# Altium schematic sheet AD9833_drive.SchDoc
size A3
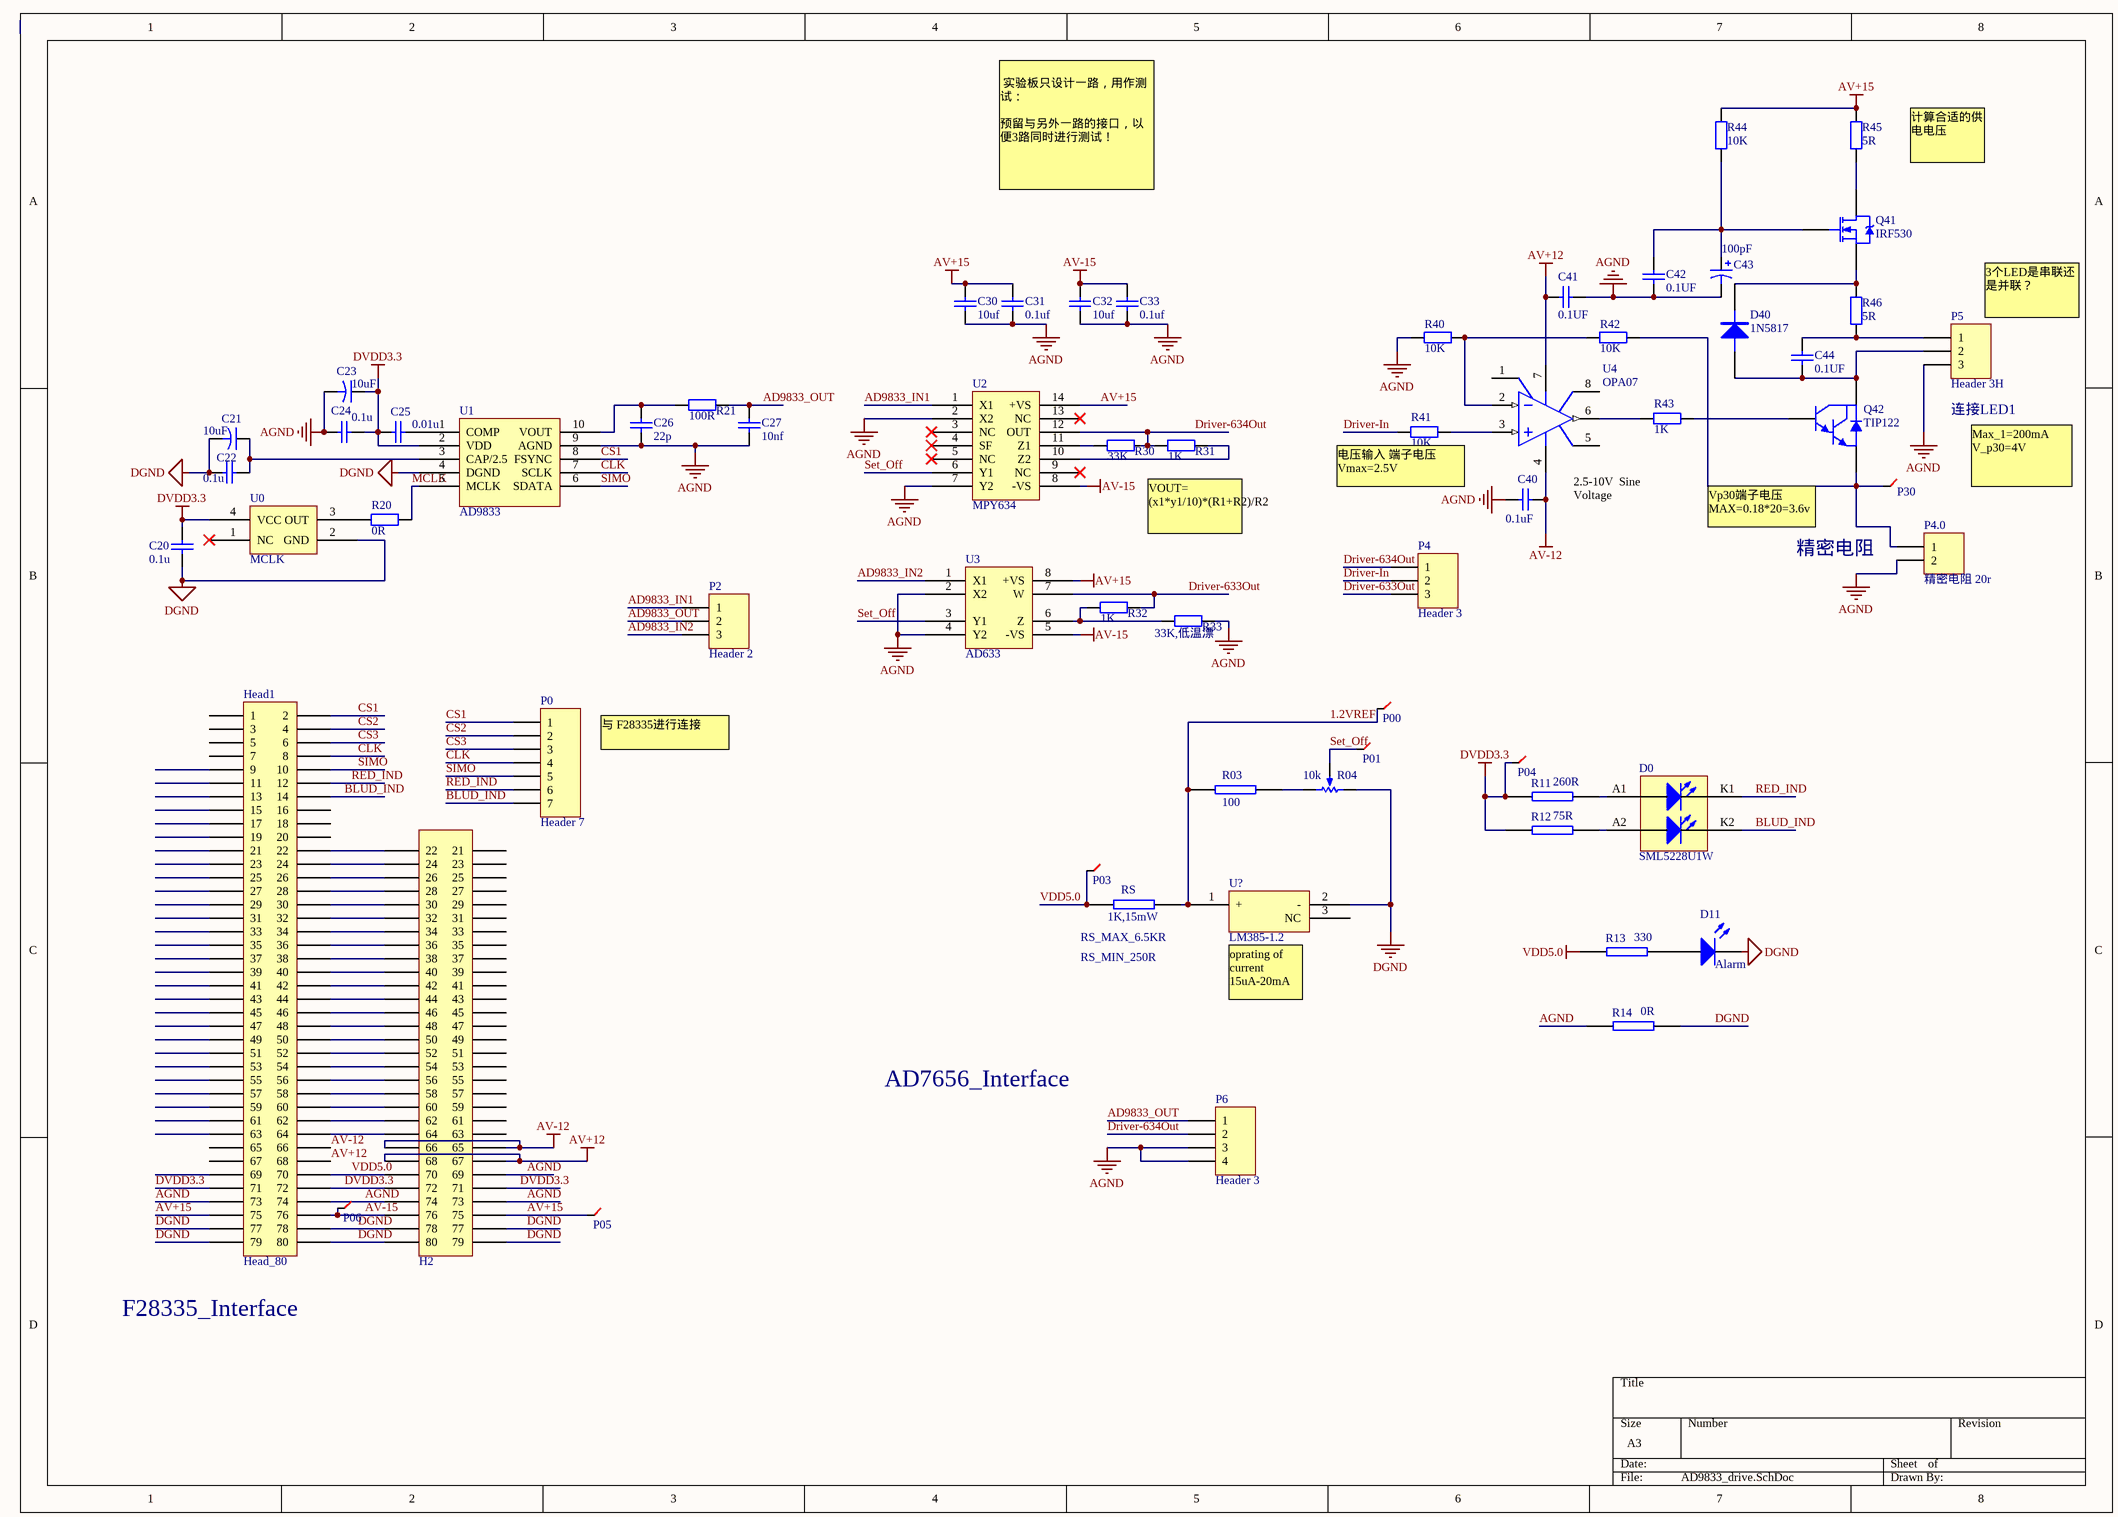
[diagram p0: AD9833_drive.SchDoc]

## Parts
C20  value 0.1u  [0805]  (hidden comment: Cap)
C21  value 10uF  [0805]  (hidden comment: Cap2)
C22  value 0.1u  [0805]  (hidden comment: Cap)
C23  value 10uF  [0805]  (hidden comment: Cap2)
C24  value 0.1u  [0805]  (hidden comment: Cap)
C25  value 0.01u  [0805]  (hidden comment: Cap)
C26  value 22p  [0805]  (hidden comment: Cap)
C27  value 10nf  [0805]  (hidden comment: Cap)
C30  value 10uf  [0805]  (hidden comment: Cap)
C31  value 0.1uf  [0805]  (hidden comment: Cap)
C32  value 10uf  [0805]  (hidden comment: Cap)
C33  value 0.1uf  [0805]  (hidden comment: Cap)
C40  value 0.1uF  [0805]  (hidden comment: Cap)
C41  value 0.1UF  [0805]  (hidden comment: Cap)
C42  value 0.1UF  [0805]  (hidden comment: Cap)
C43  value 100pF  [0805]  (hidden comment: Cap Pol1)
C44  value 0.1UF  [0805]  (hidden comment: Cap)
D0  SML5228U1W  [LED_0603双色]
D11  Alarm  [LED_0805]
D40  1N5817  [DIODE-SMA]
H2  Head60  [Head_60pin]  (value not drawn)
Head1  Head_80  [2.0mm]
P0  Header 7  [HDR1X7]
P00  测试点  (value not drawn)
P01  测试点  (value not drawn)
P2  Header 2  [HDR1X3]
P03  测试点  (value not drawn)
P4  Header 3  [HDR1X3]
P04  测试点  (value not drawn)
P4.0  精密电阻 20r  [RX70-0.25W]
P5  Header 3H  [HDR1X3]
P05  测试点  (value not drawn)
P6  Header 3  [HDR1X4]
P06  测试点  (value not drawn)
P30  测试点  (value not drawn)
Q41  IRF530  [TIP122]
Q42  TIP122  [TIP122]
R03  100  [0805]
R04  value 10k  [VR5]  (hidden comment: RPot)
R11  260R  [0805]
R12  75R  [0805]
R13  330  [0805]
R14  0R  [0805]
R20  value 0R  [0805]  (hidden comment: Res2)
R21  value 100R  [0805]  (hidden comment: Res2)
R30  value 33K  [0805]  (hidden comment: Res2)
R31  value 1K  [0805]  (hidden comment: Res2)
R32  value 1K  [0805]  (hidden comment: Res2)
R33  value 33K,低温漂  [0805]  (hidden comment: Res2)
R40  value 10K  [0805]  (hidden comment: Res2)
R41  value 10K  [0805]  (hidden comment: Res2)
R42  value 10K  [0805]  (hidden comment: Res2)
R43  value 1K  [0805]  (hidden comment: Res2)
R44  value 10K  [0805]  (hidden comment: Res2)
R45  value 5R  [0805]  (hidden comment: Res2)
R46  value 5R  [0805]  (hidden comment: Res2)
RS  1K,15mW  [0805]
U0  MCLK  [X-CPX75]
U1  AD9833  [MSOP_AD9833_10N]
U2  MPY634  [DIP-16-KEY]
U3  AD633  [DIP-8]
U4  OPA07  [SO-8-N]
U?  LM385-1.2  [TO-92]

## Nets
AGND: C23.2 C24.2 C26.1 C27.1 C30.1 C31.1 C32.1 C33.1 C40.1 C41.2 C42.2 C43.2 H2.69 H2.73 H2.74 Head1.73 Head1.74 P4.0.2 P5.3 P6.3 P6.4 R14.2 R33.2 R40.2 U1.9(AGND) U2.2(X2) U2.7(Y2) U3.2(X2) U3.4(Y2)
AV+12: C41.1 H2.67 H2.68 Head1.68 U4.7(V+)
AV+15: C30.2 C31.2 H2.75 Head1.75 P05.0 R44.1 R45.1 U2.14(+VS) U3.8(+VS)
AV-12: C40.2 H2.65 H2.66 Head1.66 U4.4(V-)
AV-15: C32.2 C33.2 H2.76 Head1.76 P06.0 U2.8(-VS) U3.5(-VS)
DGND: C20.2 C21.2 C22.2 D11.2(K) H2.77 H2.78 H2.79 H2.80 Head1.77 Head1.78 Head1.79 Head1.80 R04.1(TOP) R14.1 U0.2(GND) U1.4(DGND) U?.2(-)
DVDD3.3: C20.1 C23.1 C24.1 C25.2 H2.71 H2.72 Head1.71 Head1.72 P04.0 R11.2 R12.2 U0.4(VCC) U1.2(VDD)
VDD5.0: H2.70 Head1.70 P03.0 R13.2 RS.2
1.2VREF: P00.0 R03.2 RS.1 U?.1(+)
AD9833_IN1: P2.1 U2.1(X1)
AD9833_IN2: P2.3 U3.1(X1)
AD9833_OUT: C27.2 P2.2 P6.1 R21.2
BLUD_IND: D0.K2 Head1.14 P0.7
CLK: Head1.8 P0.4 U1.7(SCLK)
CS1: Head1.2 P0.1 U1.8(FSYNC)
CS2: Head1.4 P0.2
CS3: Head1.6 P0.3
Driver-633Out: P4.3 R32.2 U3.7(W)
Driver-634Out: P4.1 P6.2 R30.2 R31.1 U2.12(OUT)
Driver-In: P4.2 R41.1
MCLK: R20.2 U1.5(MCLK)
RED_IND: D0.K1 Head1.12 P0.6
Set_Off: P01.0 R04.2(TAP) U2.6(Y1) U3.3(Y1)
SIMO: Head1.10 P0.5 U1.6(SDATA)
NetC21_1: C21.1 C22.1 U1.3(CAP/2.5)
NetC25_1: C25.1 U1.1(COMP)
NetC26_2: C26.2 R21.1 U1.10(VOUT)
NetC42_1: C42.1 C43.1 Q41.1(G) R44.2
NetC44_1: C44.1 P5.1 R46.1
NetC44_2: C44.2 D40.1(A) P5.2 Q42.2(C)
NetD0_A1: D0.A1 R11.1
NetD0_A2: D0.A2 R12.1
NetD11_1: D11.1(A) R13.1
NetD40_2: D40.2(K) Q41.3(S) R46.2
NetH2_22: H2.22 Head1.22
NetH2_24: H2.24 Head1.24
NetH2_26: H2.26 Head1.26
NetH2_28: H2.28 Head1.28
NetH2_30: H2.30 Head1.30
NetH2_32: H2.32 Head1.32
NetH2_34: H2.34 Head1.34
NetH2_36: H2.36 Head1.36
NetH2_38: H2.38 Head1.38
NetH2_40: H2.40 Head1.40
NetH2_42: H2.42 Head1.42
NetH2_44: H2.44 Head1.44
NetH2_46: H2.46 Head1.46
NetH2_48: H2.48 Head1.48
NetH2_50: H2.50 Head1.50
NetH2_52: H2.52 Head1.52
NetH2_54: H2.54 Head1.54
NetH2_56: H2.56 Head1.56
NetH2_58: H2.58 Head1.58
NetH2_60: H2.60 Head1.60
NetH2_62: H2.62 Head1.62
NetH2_64: H2.64 Head1.64
NetP4.0_1: P4.0.1 P30.0 Q42.3(E) R42.2
NetQ41_2: Q41.2(D) R45.2
NetQ42_1: Q42.1(B) R43.1
NetR03_1: R03.1 R04.3(BOT)
NetR20_1: R20.1 U0.3(OUT)
NetR30_1: R30.1 U2.11(Z1)
NetR31_2: R31.2 U2.10(Z2)
NetR32_1: R32.1 R33.1 U3.6(Z)
NetR40_1: R40.1 R42.1 U4.2(IN-)
NetR41_2: R41.2 U4.3(IN+)
NetR43_2: R43.2 U4.6(OUT)

Not connected (* = marked no-connect by the designer): H2 21 23 25 27 29 31 33 35 37 39 41 43 45 47 49 51 53 55 57 59 61 63; Head1 1 3 5 7 9 11 13 15 16 17 18 19 20 21 23 25 27 29 31 33 35 37 39 41 43 45 47 49 51 53 55 57 59 61 63 65 67 69; U0 1(NC)*; U2 3(NC)* 4(SF)* 5(NC)* 9(NC)* 13(NC)*; U4 1(VOSTRIM) 5(NC) 8(VOSTRIM); U? 3(NC)

## Notes on the sheet
- 实验板只设计一路，用作测试：
  预留与另外一路的接口，以便3路同时进行测试！
- 计算合适的供电电压
- (near P5) 3个LED是串联还是并联？
- 应为AVDD3.3供电
- RC低通滤波器
  截止：159KHZ
- (near P5) 连接LED1
- (near R41) 电压输入 端子电压Vmax=2.5V
- 2.5-10V  Sine Voltage
- (near Q42) Vp30端子电压MAX=0.18*20=3.6v
- Max_1=200mA
  V_p30=4V
- ad9833
  20mW
  6.7mA
- (near U2) MPY634 PDIP
  Iq=4mA
  约0.12W
- VOUT=
  (x1*y1/10)*(R1+R2)/R2
- 精密电阻
- (near U3) MPY634太贵
  预留AD633测试接口，二者不能同时接通
- 与 F28335进行连接
- (near RS) RS_MAX_6.5KR
- (near RS) RS_MIN_250R
- (near U?) oprating of current 15uA-20mA
- AD7656_Interface
- F28335_Interface

## Library data of the parts
C20 C22 C24-C27 C30-C33 C40-C42 C44 = Cap: Capacitor; Published: 8-Jun-2000; LatestRevisionDate: 17-Jul-2002; LatestRevisionNote: Re-released for DXP Platform.; PackageReference: RAD-0.3; Publisher: Altium Limited
C21 C23 = Cap2: Capacitor; Published: 23-Sep-2002; PackageReference: CAPR5-4X5; Publisher: Altium Limited
C43 = Cap Pol1: Polarized Capacitor (Radial); Published: 8-Jun-2000; LatestRevisionDate: 17-Jul-2002; LatestRevisionNote: Re-released for DXP Platform.; PackageReference: RB7.6-15; Publisher: Altium Limited
D11 = LED0: Typical INFRARED GaAs LED; Published: 8-Jun-2000; LatestRevisionDate: 08-Jul-2005; LatestRevisionNote: Mech Layer 1 removed.; PackageReference: LED-0; Publisher: Altium Limited
D40 = DIODE
H2 = Head_60
P0 = Header 7: Header, 7-Pin; LatestRevisionDate: 17-Jul-2002; LatestRevisionNote: Re-released for DXP Platform.; Publisher: Altium Limited
P2 P4 = Header 3: Header, 3-Pin; LatestRevisionDate: 17-Jul-2002; LatestRevisionNote: Re-released for DXP Platform.; Publisher: Altium Limited
P4.0 = Header 2: Header, 2-Pin; LatestRevisionDate: 17-Jul-2002; LatestRevisionNote: Re-released for DXP Platform.; Publisher: Altium Limited
P5 = Header 3H: Header, 3-Pin, Right Angle; LatestRevisionDate: 17-Jul-2002; LatestRevisionNote: Re-released for DXP Platform.; Publisher: Altium Limited
P6 = Header 4: Header, 4-Pin; LatestRevisionDate: 17-Jul-2002; LatestRevisionNote: Re-released for DXP Platform.; Publisher: Altium Limited
Q41 = NMOS-2: N-Channel Power MOSFET; Note: Pin 2 is electrically connected to pin 4.; Published: 8-Jun-2000; LatestRevisionDate: 17-Jul-2002; LatestRevisionNote: Re-released for DXP Platform.; DatasheetDocument: PD-9.814; PackageReference: TO-220AB; Publisher: Altium Limited; Code_JEDEC: TO-220-AB; ComponentLink1Description: Manufacturer Link; ComponentLink1URL: http://www.irf.com/
Q42 = NPN2: NPN Darlington Bipolar Transistor; Published: 8-Jun-2000; LatestRevisionDate: 17-Jul-2002; LatestRevisionNote: Re-released for DXP Platform.; PackageReference: TO-226; Publisher: Altium Limited; Code_JEDEC: TO-226-AE
R03 R11-R14 RS = RES2
R04 = RPot: Potentiometer; Sim Note: Enter the Resistance value and the set point into parameter fields.; Set Position: 0.5; Published: 8-Jun-2000; LatestRevisionDate: 17-Jul-2002; LatestRevisionNote: Re-released for DXP Platform.; PackageReference: VR5; Publisher: Altium Limited
R20 R21 R30-R33 R40-R46 = Res2: Resistor; Published: 8-Jun-2000; LatestRevisionDate: 17-Jul-2002; LatestRevisionNote: Re-released for DXP Platform.; PackageReference: AXIAL-0.4; Publisher: Altium Limited
U0 = MCLK: 有源晶振1MHZ ,5V
U1 = AD9833: 波形发生器
U2 = Mpy634_DIPN_16
U3 = AD633_DIP_8
U4 = OP37GS: Low-Noise, Precision, High-Speed Operational Amplifier (Avcl >= 5); Note: Pin 5 is not connected.; Published: 8-Jun-2000; LatestRevisionDate: 13-Apr-2006; LatestRevisionNote: IPC-7351 Footprint Added.; DatasheetVersion: 1992; PackageVersion: revA; PackageReference: SO-8; Publisher: Altium Limited; PackageDescription: 8-Pin Small Outline Integrated Circuit 1.27 mm Pitch; Code_JEDEC: MS-012-AA; Code_IPC: SOIC127P600-8; ComponentLink1Description: Manufacturer Link; ComponentLink1URL: http://www.analog.com/en/prod/0,,759_786_OP37%2C00.html; ComponentLink2Description: Datasheet; ComponentLink2URL: http://www.analog.com/UploadedFiles/Data_Sheets/5021673OP37_b.pdf
U? = LM385m-1.2 S0T-23